# EAGLE design relays (EAGLE 9.0.1)
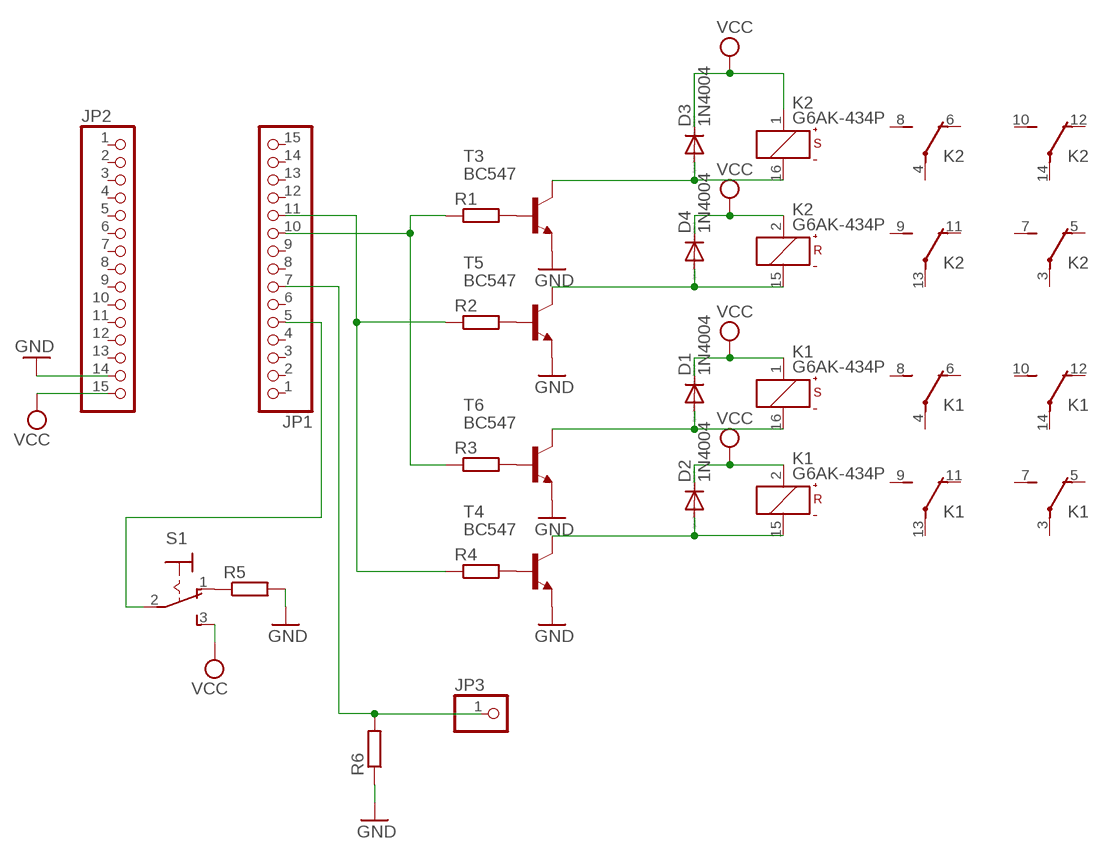
[diagram p0: schematic, sheet 1]

## Parts
D1  1N4004  [DO41-10]
D2  1N4004  [DO41-10]
D3  1N4004  [DO41-10]
D4  1N4004  [DO41-10]
JP1  PINHD-1X15  [1X15]
JP2  PINHD-1X15  [1X15]
JP3  PINHD-1X1  [1X01]
K1  G6AK-434P  [G6AK-434P]
K2  G6AK-434P  [G6AK-434P]
R1  R-EU_0207/10  [0207/10]
R2  R-EU_0207/10  [0207/10]
R3  R-EU_0207/10  [0207/10]
R4  R-EU_0207/10  [0207/10]
R5  R-EU_0207/10  [0207/10]
R6  R-EU_0207/10  [0207/10]
S1  320-916  [320-916]
T3  BC547  [TO92]
T4  BC547  [TO92]
T5  BC547  [TO92]
T6  BC547  [TO92]

## Nets
GND: JP2.14 R5.2 R6.1 T3.1(E) T4.1(E) T5.1(E) T6.1(E)
N$1: R1.2 T3.2(B)
N$2: D3.A K2.16(-S:-) T3.3(C)
N$3: R2.2 T5.2(B)
N$4: D4.A K2.15(-R:-) T5.3(C)
N$5: D1.A K1.16(-S:-) T6.3(C)
N$6: R3.2 T6.2(B)
N$7: R4.2 T4.2(B)
N$8: D2.A K1.15(-R:-) T4.3(C)
N$9: R5.1 S1.1(O)
N$10: JP1.5 S1.2(P)
N$11: JP1.11 R2.1 R4.1
N$12: JP1.10 R1.1 R3.1
N$14: JP1.7 JP3.1 R6.2
VCC: D1.C D2.C D3.C D4.C JP2.15 K1.1(-S:+) K1.2(-R:+) K2.1(-S:+) K2.2(-R:+) S1.3(S)
Unconnected: JP1.1 JP1.2 JP1.3 JP1.4 JP1.6 JP1.8 JP1.9 JP1.12 JP1.13 JP1.14 JP1.15 JP2.1 JP2.2 JP2.3 JP2.4 JP2.5 JP2.6 JP2.7 JP2.8 JP2.9 JP2.10 JP2.11 JP2.12 JP2.13 K1.3(-4:P) K1.4(-1:P) K1.5(-4:O) K1.6(-1:O) K1.7(-4:S) K1.8(-1:S) K1.9(-2:S) K1.10(-3:S) K1.11(-2:O) K1.12(-3:O) K1.13(-2:P) K1.14(-3:P) K2.3(-4:P) K2.4(-1:P) K2.5(-4:O) K2.6(-1:O) K2.7(-4:S) K2.8(-1:S) K2.9(-2:S) K2.10(-3:S) K2.11(-2:O) K2.12(-3:O) K2.13(-2:P) K2.14(-3:P)

## Library data of the parts
D1-D4 = diode:1N4004: DIODE general purpose rectifier, 1 A
JP1 JP2 = pinhead:PINHD-1X15: PIN HEADER
JP3 = pinhead:PINHD-1X1: PIN HEADER
K1 K2 = relay:G6AK-434P: RELAY 4 x switch, dual coil latching, 0.3 A/125 V AC, 1 A/30 V DC, Omron; OC_FARNELL: unknown; OC_NEWARK: unknown
R1-R6 = resistor:R-EU_: RESISTOR, European symbol
S1 = switch:320-916: TOGGLE SWITCH distributor RS Components
T3-T6 = transistor:BC547: NPN TRANSISTOR

## Board
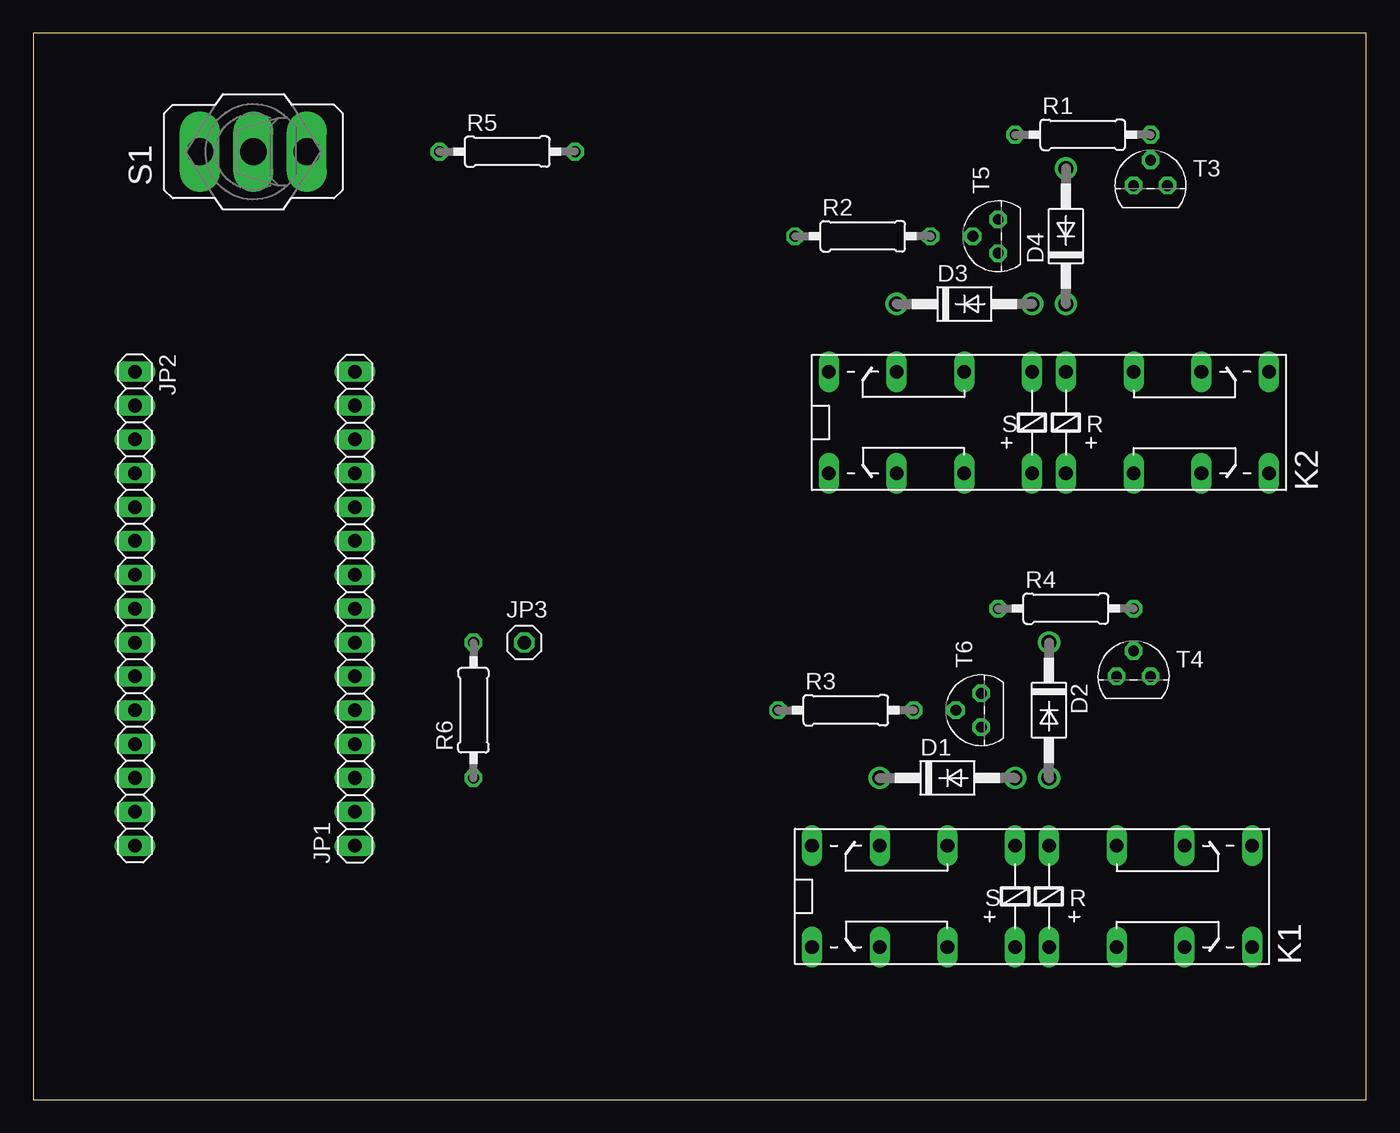
[diagram p1: board, top side]
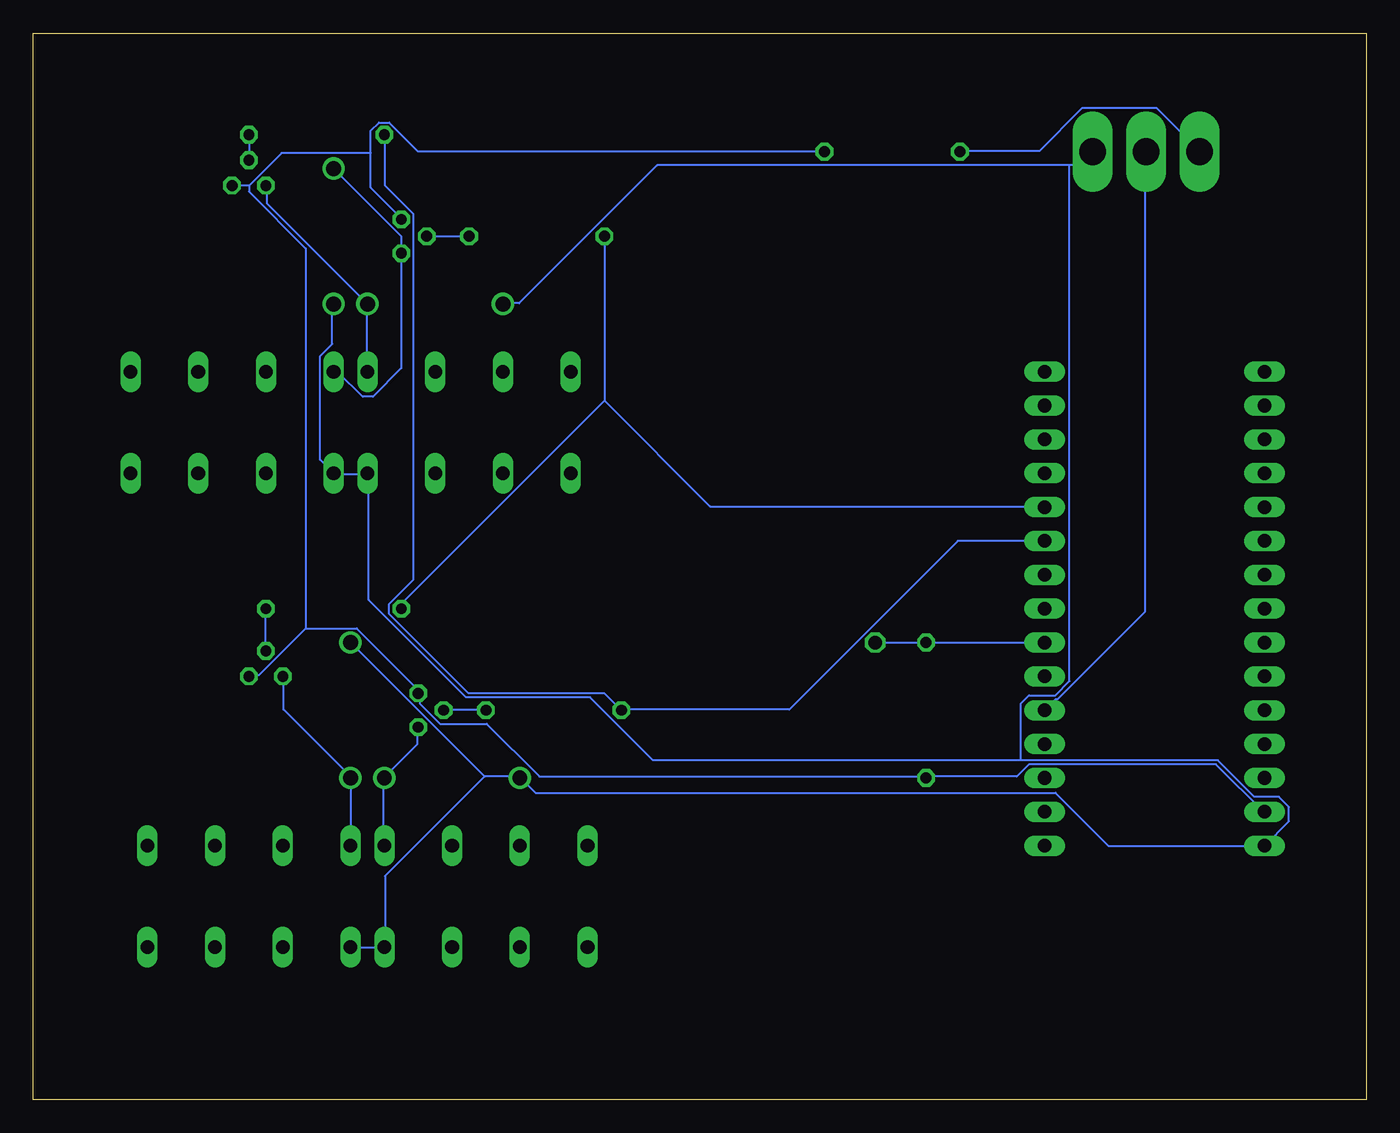
[diagram p2: board, bottom side, seen from below]

Size 100 x 80 mm. Coordinates in mm from the lower left corner, seen from the top.
Outline: 0,0 100,0 100,80 0,80 0,0
Copper layers (1*16): Top 0.035mm / dielectric 1.5mm / Bottom 0.035mm
Design rules "default": minimum track width 6mil, minimum drill 0.35mm, track to track 6mil, track to pad 6mil, pad to pad 6mil, via to via 6mil, smd to smd 6mil, copper to edge 40mil, drill to drill 6mil, minimum pad ring 10mil, minimum via ring 8mil, stop-mask expansion 4mil, vias tented up to drill 0mil, thermal gap 10mil

### Footprints (pad centres in the part's own frame; a part is rotated, then mirrored left to right if it is on the bottom)
DO41-10 = drill 1.118: A 5.08,0; C -5.08,0
1X15 = drill 1.016 long: 1 -17.78,0; 2 -15.24,0; 3 -12.7,0; 4 -10.16,0; 5 -7.62,0; 6 -5.08,0; 7 -2.54,0; 8 0,0; 9 2.54,0; 10 5.08,0; 11 7.62,0; 12 10.16,0; 13 12.7,0; 14 15.24,0; 15 17.78,0
1X01 = drill 1.016 octagon: 1 0,0
G6AK-434P = drill 1.016 long: 1 -1.27,-3.81; 2 1.27,-3.81; 3 -6.35,-3.81; 4 6.35,-3.81; 5 -11.43,-3.81; 6 11.43,-3.81; 7 -16.51,-3.81; 8 16.51,-3.81; 9 16.51,3.81; 10 -16.51,3.81; 11 11.43,3.81; 12 -11.43,3.81; 13 6.35,3.81; 14 -6.35,3.81; 15 1.27,3.81; 16 -1.27,3.81
0207/10 = drill 0.813 octagon: 1 -5.08,0; 2 5.08,0
320-916 = drill 2.007 long: 1 0,4.013; 2 0,0; 3 0,-4.013
TO92 = drill 0.813 octagon: 1 1.27,0; 2 0,1.905; 3 -1.27,0

### Placement (x,y rotation side)
D1  68.58,24.13 0 top
D2  76.2,29.21 270 top
D3  69.85,59.69 0 top
D4  77.47,64.77 90 top
JP1  24.13,36.83 90 top
JP2  7.62,36.83 270 top
JP3  36.83,34.29 0 top
K1  74.93,15.24 0 top
K2  76.2,50.8 0 top
R1  78.74,72.39 0 top
R2  62.23,64.77 0 top
R3  60.96,29.21 0 top
R4  77.47,36.83 0 top
R5  35.56,71.12 0 top
R6  33.02,29.21 90 top
S1  16.51,71.12 90 top
T3  83.82,68.58 0 top
T4  82.55,31.75 0 top
T5  72.39,64.77 90 top
T6  71.12,29.21 90 top

### Tracks (layer width: path | path; a pad name or v marks a point on that pad's centre or on a via)
GND
  Bottom 0.152: JP2.14 7.62,21.49 11.28,25.15 25.3,25.15 26.21,24.23 32.92,24.23 R6.1 33.07,24.23 62.03,24.23 65.99,28.19 69.49,28.19 71.02,29.72 71.02,30.48 T6.1 71.17,30.48 71.17,30.79 75.74,35.36 79.55,35.36 | 79.55,35.36 83.06,31.85 83.82,31.85 T4.1 | 74.68,71.02 74.68,68.43 72.39,66.14 T5.1 | 74.68,71.02 74.68,72.69 74.07,73.3 73.3,73.3 71.17,71.17 40.69,71.17 R5.2 | 83.82,68.58 T3.1 | 83.82,68.58 81.38,71.02 74.68,71.02 | 79.55,35.36 79.55,63.86 83.82,68.12 83.82,68.58
N$1
  Bottom 0.152: R1.2 T3.2
N$2
  Bottom 0.152: T3.3 82.45,68.58 82.45,67.21 D3.A 74.98,59.59 74.98,54.71 K2.16
N$3
  Bottom 0.152: T5.2 R2.2
N$4
  Bottom 0.152: D4.A 72.39,64.77 T5.3 72.39,54.86 74.52,52.73 75.29,52.73 77.11,54.56 77.42,54.56 K2.15
N$5
  Bottom 0.152: T6.3 71.17,27.89 71.17,26.67 73.61,24.23 D1.A 73.76,24.08 73.76,19.05 K1.16
N$6
  Bottom 0.152: R3.2 66.14,29.26 69.19,29.26 T6.2
N$7
  Bottom 0.152: T4.2 82.6,33.68 82.6,36.73 R4.2
N$8
  Bottom 0.152: T4.3 81.23,31.7 81.23,29.26 76.2,24.23 D2.A K1.15
N$9
  Bottom 0.152: R5.1 30.48,71.17 24.54,71.17 21.34,74.37 15.7,74.37 12.5,71.17 S1.1
N$10
  Bottom 0.152: JP1.5 23.32,30.02 23.16,30.02 16.61,36.58 16.61,71.02 S1.2
N$11
  Bottom 0.152: R4.1 72.39,37.19 57.15,52.43 | R2.1 57.15,52.43 | 57.15,52.43 49.23,44.5 24.23,44.5 JP1.11
N$12
  Bottom 0.152: JP1.10 30.63,41.91 43.28,29.26 55.78,29.26 R3.1 57.15,30.48 67.36,30.48 73.3,36.42 73.3,37.19 71.48,39.01 71.48,66.45 73.61,68.58 73.61,72.39 R1.1
N$14
  Bottom 0.152: JP3.1 R6.2 JP1.7
VCC
  Bottom 0.152: 22.25,70.1 21.49,70.1 20.57,71.02 S1.3 | 22.25,70.1 53.19,70.1 63.55,59.74 64.77,59.74 D3.C | D4.C 77.57,59.59 77.57,56.69 78.49,55.78 78.49,48.01 K2.2 77.42,46.94 74.98,46.94 K2.1 74.83,46.94 74.83,37.49 67.51,30.18 58.22,30.18 53.49,25.45 25.91,25.45 | K1.2 K1.1 73.61,11.43 73.61,16.76 66.14,24.23 | 66.14,24.23 D2.C | 66.14,24.23 63.55,24.23 D1.C 63.4,24.08 62.33,23.01 23.32,23.01 19.36,19.05 JP2.15 5.79,20.88 5.79,21.95 6.55,22.71 8.38,22.71 11.12,25.45 25.91,25.45 | 22.25,70.1 22.25,31.39 23.32,30.33 25.3,30.33 25.91,29.72 25.91,25.45